# EAGLE design GBA VU Meter Main Board v1.0 (EAGLE 6.4)
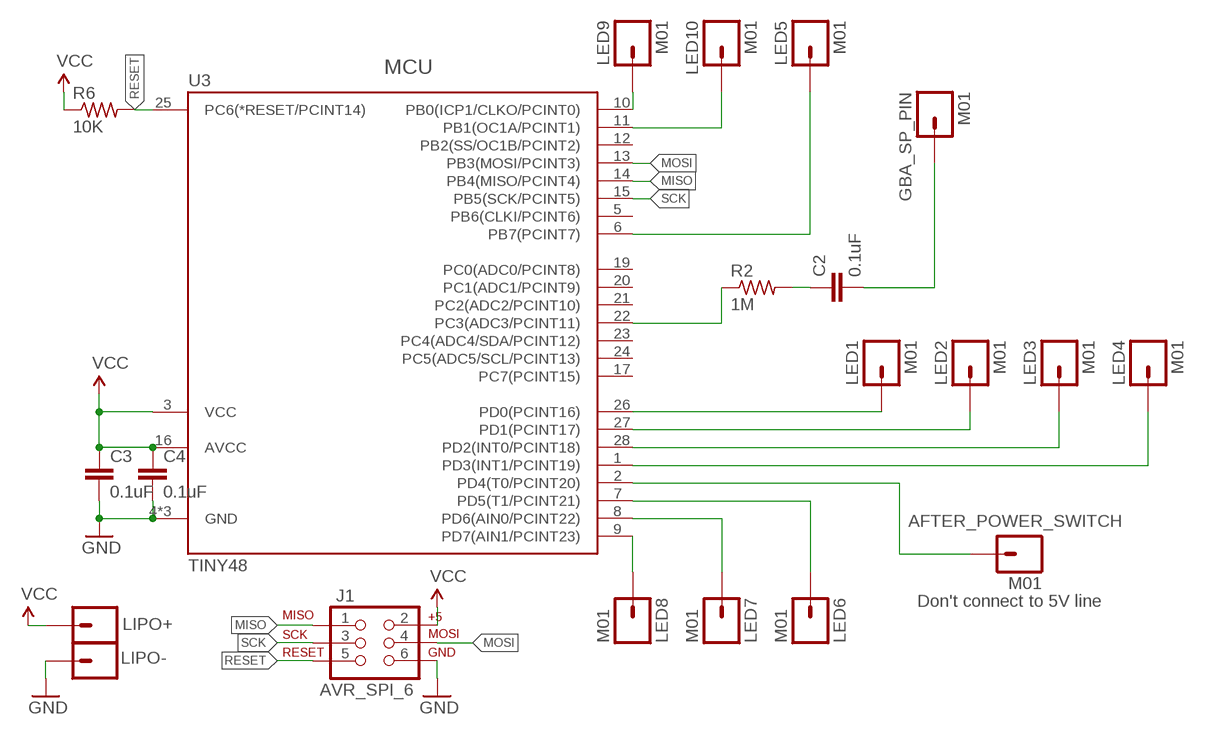
[diagram p0: schematic, sheet 1]

## Parts
AFTER_POWER_SWITCH  M01  [1X01_SMD_SM]
C2  0.1uF  CAP0603  [C0603K]
C3  0.1uF  CAP0603  [C0603K]
C4  0.1uF  CAP0603  [C0603K]
GBA_SP_PIN  M01  [1X01_SMD_SM]
J1  AVR_SPI_6  AVR_SPI_PRG_6  [2X3_2]
LED1  M01  [1X01_SMD_SM]
LED2  M01  [1X01_SMD_SM]
LED3  M01  [1X01_SMD_SM]
LED4  M01  [1X01_SMD_SM]
LED5  M01  [1X01_SMD_SM]
LED6  M01  [1X01_SMD_SM]
LED7  M01  [1X01_SMD_SM]
LED8  M01  [1X01_SMD_SM]
LED9  M01  [1X01_SMD_SM]
LED10  M01  [1X01_SMD_SM]
LIPO+  M01SMALL  [1X01_SMD_SMALL]
LIPO-  M01SMALL  [1X01_SMD_SMALL]
R2  1M  R-US_R0603_S  [R0603_S]
R6  10K  R-US_R0603_S  [R0603_S]
U3  TINY48  [VQFN-28]

## Nets
GND: C3.2 C4.2 J1.6 LIPO-.1 U3.4(GND) U3.18(GND) U3.29(GND)
MISO: J1.1 U3.14(PB4(MISO/PCINT4))
MOSI: J1.4 U3.13(PB3(MOSI/PCINT3))
N$1: LED1.P$1 U3.26(PD0(PCINT16))
N$2: LED2.P$1 U3.27(PD1(PCINT17))
N$3: R2.1 U3.22(PC3(ADC3/PCINT11))
N$4: C2.1 R2.2
N$5: LED4.P$1 U3.1(PD3(INT1/PCINT19))
N$6: LED5.P$1 U3.6(PB7(PCINT7))
N$7: LED3.P$1 U3.28(PD2(INT0/PCINT18))
N$8: AFTER_POWER_SWITCH.P$1 U3.2(PD4(T0/PCINT20))
N$9: LED9.P$1 U3.10(PB0(ICP1/CLKO/PCINT0))
N$10: LED10.P$1 U3.11(PB1(OC1A/PCINT1))
N$11: C2.2 GBA_SP_PIN.P$1
N$14: LED6.P$1 U3.7(PD5(T1/PCINT21))
N$15: LED7.P$1 U3.8(PD6(AIN0/PCINT22))
N$16: LED8.P$1 U3.9(PD7(AIN1/PCINT23))
RESET: J1.5 R6.2 U3.25(PC6(*RESET/PCINT14))
SCK: J1.3 U3.15(PB5(SCK/PCINT5))
VCC: C3.1 C4.1 J1.2 LIPO+.1 R6.1 U3.3(VCC) U3.16(AVCC)
Unconnected: U3.5(PB6(CLKI/PCINT6)) U3.12(PB2(SS/OC1B/PCINT2)) U3.17(PC7(PCINT15)) U3.19(PC0(ADC0/PCINT8)) U3.20(PC1(ADC1/PCINT9)) U3.21(PC2(ADC2/PCINT10)) U3.23(PC4(ADC4/SDA/PCINT12)) U3.24(PC5(ADC5/SCL/PCINT13))

## Notes on the sheet
- MCU
- Don't connect to 5V line

## Library data of the parts
AFTER_POWER_SWITCH GBA_SP_PIN LED1-LED10 LIPO+ LIPO- = SparkFun:M01: Header 1 Standard 1-pin 0.1" header. Use with straight break away headers (SKU : PRT-00116), right angle break away headers (PRT-00553), swiss pins (PRT-00743), machine pins (PRT-00117), and female headers (PRT-00115).
C2-C4 = adafruit:CAP
J1 = SparkFun:AVR_SPI_PRG_6: AVR ISP 6 Pin This is the reduced ISP connector for AVR programming. Common on Arduino. This footprint will take up less PCB space and can be used with a 10-pin to 6-pin adapter such as SKU: BOB-08508
R2 R6 = adafruit:R-US_: RESISTOR, American symbol
U3 = avr-5:TINY48

## Board
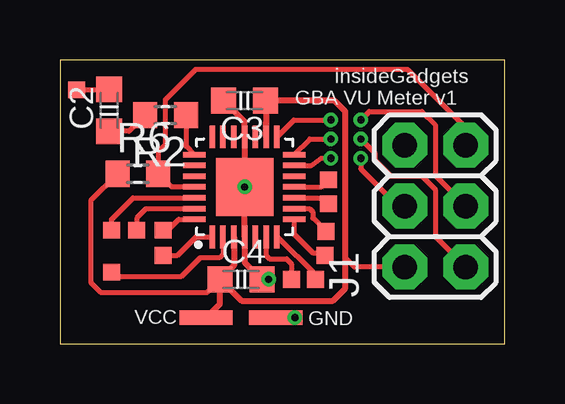
[diagram p1: board, top side]
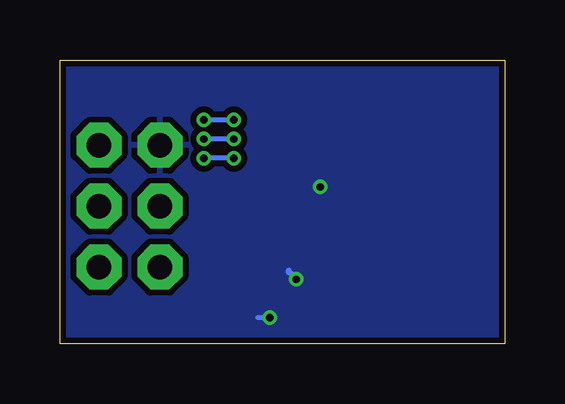
[diagram p2: board, bottom side, seen from below]

Size 18.55 x 11.85 mm. Coordinates in mm from the lower left corner, seen from the top.
Outline: 0,0 18.55,0 18.55,11.85 0,11.85 0,0
Copper layers (1*16): Top 0.035mm / dielectric 1.5mm / Bottom 0.035mm
Design rules "ITEADstudio_DRC": minimum track width 6mil, minimum drill 12mil, track to track 6mil, track to pad 6mil, pad to pad 6mil, via to via 6mil, smd to smd 0mil, copper to edge 10mil, drill to drill 10mil, minimum pad ring 10mil, minimum via ring 6mil, stop-mask expansion 2mil, vias tented up to drill 100mil, thermal gap 10mil

### Footprints (pad centres in the part's own frame; a part is rotated, then mirrored left to right if it is on the bottom)
1X01_SMD_SM = smd 0.7 x 0.7: P$1 0,0
C0603K = smd 1.05 x 1.08: 1 -0.875,0; 2 0.875,0
2X3_2 = drill 1.016 pad 1.88 octagon: 1 -2.54,-1.27; 2 -2.54,1.27; 3 0,-1.27; 4 0,1.27; 5 2.54,-1.27; 6 2.54,1.27
1X01_SMD_SMALL = smd 0.61 x 2.21: 1 0,0
R0603_S = smd 1 x 1.1: 1 -0.85,0; 2 0.85,0
VQFN-28 = smd 0.95 x 0.23: 1 -2.08,1.35; 2 -2.08,0.9; 3 -2.08,0.45; 4 -2.08,0; 5 -2.08,-0.45; 6 -2.08,-0.9; 7 -2.08,-1.35; 15 2.09,-1.35; 16 2.09,-0.9; 17 2.09,-0.45; 18 2.09,0; 19 2.09,0.45; 20 2.09,0.9; 21 2.09,1.35 | smd 0.23 x 0.95: 8 -1.35,-2.07; 9 -0.9,-2.07; 10 -0.45,-2.07; 11 0,-2.07; 12 0.45,-2.07; 13 0.9,-2.07; 14 1.35,-2.07; 22 1.35,2.1; 23 0.9,2.1; 24 0.45,2.1; 25 0,2.1; 26 -0.45,2.1; 27 -0.9,2.1; 28 -1.35,2.1 | smd 2.4 x 2.4: 29 0,0

### Placement (x,y rotation side)
AFTER_POWER_SWITCH  2.15,3 0 top
C2  2.05,9.75 90 top
C3  7.7,10.15 180 top
C4  7.55,2.7 0 top
GBA_SP_PIN  0.7,10.6 0 top
J1  15.65,5.75 90 top
LED1  2.15,4.75 0 top
LED2  3.2,4.75 0 top
LED3  4.3,4.75 0 top
LED4  4.3,3.7 0 top
LED5  9.65,2.7 0 top
LED6  10.65,2.7 0 top
LED7  11.05,3.7 0 top
LED8  11.1,4.7 0 top
LED9  11.2,5.85 0 top
LED10  11.2,6.85 0 top
LIPO+  6.1,1.1 270 top
LIPO-  9,1.1 270 top
R2  4.4,9.55 180 top
R6  3.25,7.1 0 top
U3  7.7,6.55 90 top

### Tracks (layer width: path | path; a pad name or v marks a point on that pad's centre or on a via)
GND  (via drill 0.3)
  Top 0.203: LIPO-.1 v9.8,1.1
  Top 0.254: C3.2 7.7,9.27 U3.18 U3.29 U3.4 7.7,3.4 8.4,2.7 | C4.2 v8.7,2.7
  Bottom 0.203: v9.8,1.1 10.3,1.1
  Bottom 0.254: v8.7,2.7 9,3 9,3.05
  other vias: 7.7,6.55
  pour Bottom (isolate 0.254): -13.4,22.5 40.3,20.65 41.75,-16.9 -17.35,-16.05
MISO  (via drill 0.3)
  Top 0.203: J1.1 15.65,4.48 15.65,6.45 15.1,7 13.8,7 13.15,7.65 13.15,7.95 v12.55,8.55 | U3.14 10.42,8.55 v11.3,8.55
  Bottom 0.203: v11.3,8.55 v12.55,8.55
MOSI  (via drill 0.3)
  Top 0.203: U3.13 10.5,7.45 10.9,7.75 v11.3,7.75 | v12.55,7.75 12.55,7.3 14.1,5.75 J1.4
  Bottom 0.203: v11.3,7.75 v12.55,7.75
N$1
  Top 0.203: U3.26 3.05,6.1 2.15,5.2 LED1.P$1
N$2
  Top 0.203: U3.27 3.6,5.65 3.2,5.25 LED2.P$1 3.35,4.85
N$3
  Top 0.203: R2.1 5.25,8.25 U3.22
N$4
  Top 0.203: R2.2 2.88,8.88 C2.1
N$5
  Top 0.203: LED4.P$1 4.9,3.7 5.67,4.47 U3.1
N$6
  Top 0.203: U3.6 8.6,3.7 8.75,3.55 9.45,3.55 9.65,3.35 LED5.P$1
N$7
  Top 0.203: U3.28 4.95,5.2 4.6,4.85 LED3.P$1
N$8
  Top 0.203: U3.2 6.8,3.75 6.65,3.6 5.85,3.6 5.05,2.8 2.35,2.8 AFTER_POWER_SWITCH.P$1
N$9
  Top 0.203: U3.10 10.95,6.1 LED9.P$1
N$10
  Top 0.203: U3.11 10.9,6.55 LED10.P$1
N$11
  Top 0.203: C2.2 2.03,10.6 GBA_SP_PIN.P$1
N$14
  Top 0.203: U3.7 9.08,4.47 10.65,2.9 LED6.P$1
N$15
  Top 0.203: U3.8 9.77,4.58 10.55,3.8 10.95,3.8 LED7.P$1
N$16
  Top 0.203: U3.9 10.4,5.65 10.55,5.5 10.55,5.25 LED8.P$1
RESET
  Top 0.203: U3.25 4.65,6.55 R6.2 4.1,8.05 4.4,8.35 4.4,10.2 5.65,11.45 14.5,11.45 16.92,9.03 J1.5
SCK  (via drill 0.3)
  Top 0.203: J1.3 15.65,7.02 15.65,9.15 15.1,9.7 12.9,9.7 v12.55,9.35 | U3.15 9.76,9.35 v11.3,9.35
  Bottom 0.203: v11.3,9.35 v12.55,9.35
VCC
  Top 0.203: C4.1 6.12,2.15 1.7,2.15 1.3,2.55 1.3,6 R6.1 | J1.2 12.29,3.21 11.9,3.6
  Top 0.254: 8.6,9.25 U3.16 8.6,10.12 C3.1 11.45,10.15 11.9,9.7 11.9,3.6 11.9,2.32 11.38,1.8 7.58,1.8 C4.1 | U3.3 7.25,3.28 C4.1 | LIPO+.1 6.67,1.68 C4.1

### Text on the board
_tsilk: insideGadgets | GBA VU Meter v1 | VCC | GND